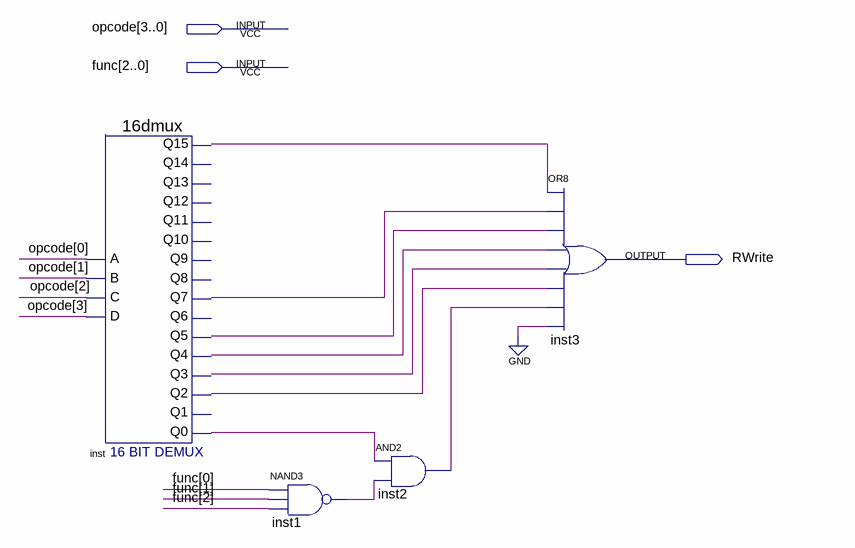
[diagram p0: schematic sheet]
// Quartus schematic RWrite.bdf as structural Verilog: 4 symbols, 3 pins
module RWrite (
  input  [3:0] opcode,
  input  [2:0] func,
  output RWrite
);

  wire inst1_out, inst2_out, inst_q0, inst_q2, inst_q3, inst_q4, inst_q5, inst_q7, inst_q15;

  \16dmux  inst (
    .C(opcode[2]), .B(opcode[1]), .A(opcode[0]), .D(opcode[3]), .Q7(inst_q7), .Q4(inst_q4), .Q5(inst_q5),
    .Q2(inst_q2), .Q3(inst_q3), .Q15(inst_q15), .Q0(inst_q0));  // open: Q12, Q13, Q11, Q9, Q10, Q8, Q6, Q14, Q1
  nand inst1 (inst1_out, func[0], func[1], func[2]);
  and inst2 (inst2_out, inst_q0, inst1_out);
  or inst3 (RWrite, inst_q15, inst_q7, inst_q5, inst_q4, inst_q3, inst_q2, inst2_out, 1'b0);
endmodule
